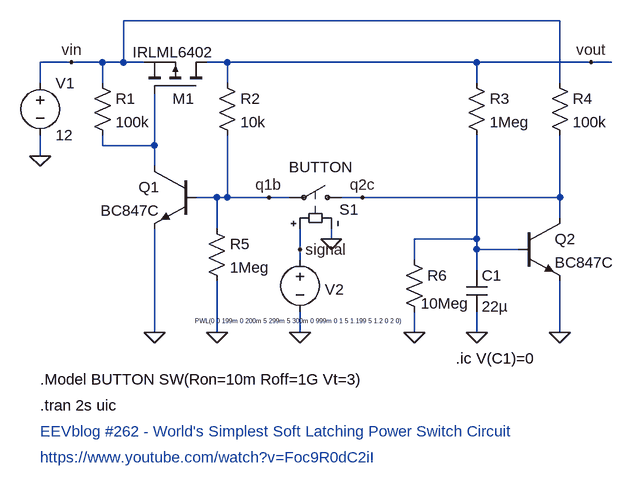
[diagram p0: schematic 02-soft_latch_power_switch.asc]
02-soft_latch_power_switch.asc, the LTspice schematic file:
Version 4
SHEET 1 1020 736
WIRE 752 0 80 0
WIRE 0 64 -48 64
WIRE 48 64 0 64
WIRE 80 64 80 0
WIRE 80 64 48 64
WIRE 112 64 80 64
WIRE 240 64 208 64
WIRE 624 64 240 64
WIRE 800 64 624 64
WIRE 832 64 800 64
WIRE -48 96 -48 64
WIRE 48 96 48 64
WIRE 240 96 240 64
WIRE 624 96 624 64
WIRE 752 96 752 0
WIRE 48 192 48 176
WIRE 128 192 128 112
WIRE 128 192 48 192
WIRE -48 208 -48 176
WIRE 128 224 128 192
WIRE 224 272 192 272
WIRE 240 272 240 176
WIRE 240 272 224 272
WIRE 304 272 240 272
WIRE 336 272 304 272
WIRE 448 272 416 272
WIRE 752 272 752 176
WIRE 752 272 448 272
WIRE 752 304 752 272
WIRE 224 320 224 272
WIRE 400 336 400 320
WIRE 624 336 624 176
WIRE 624 336 528 336
WIRE 352 352 352 320
WIRE 624 352 624 336
WIRE 688 352 624 352
WIRE 352 368 352 352
WIRE 528 368 528 336
WIRE 624 384 624 352
WIRE 128 480 128 320
WIRE 224 480 224 400
WIRE 352 480 352 448
WIRE 528 480 528 448
WIRE 624 480 624 448
WIRE 752 480 752 400
FLAG 752 480 0
FLAG 624 480 0
FLAG 400 336 0
FLAG 128 480 0
FLAG -48 208 0
FLAG 352 480 0
FLAG 0 64 vin
FLAG 800 64 vout
FLAG 304 272 q1b
FLAG 448 272 q2c
FLAG 352 352 signal
FLAG 224 480 0
FLAG 528 480 0
SYMBOL pmos 208 112 M270
WINDOW 0 -8 52 VLeft 2
WINDOW 3 64 114 VLeft 2
SYMATTR InstName M1
SYMATTR Value IRLML6402
SYMBOL res 32 80 R0
SYMATTR InstName R1
SYMATTR Value 100k
SYMBOL res 224 80 R0
SYMATTR InstName R2
SYMATTR Value 10k
SYMBOL npn 192 224 M0
SYMATTR InstName Q1
SYMATTR Value BC847C
SYMBOL res 608 80 R0
SYMATTR InstName R3
SYMATTR Value 1Meg
SYMBOL res 736 80 R0
SYMATTR InstName R4
SYMATTR Value 100k
SYMBOL npn 688 304 R0
SYMATTR InstName Q2
SYMATTR Value BC847C
SYMBOL cap 608 384 R0
SYMATTR InstName C1
SYMATTR Value 22µ
SYMBOL sw 432 272 M270
WINDOW 0 -19 19 VLeft 2
WINDOW 3 47 97 VLeft 2
SYMATTR InstName S1
SYMATTR Value BUTTON
SYMBOL voltage -48 80 R0
WINDOW 123 0 0 Left 0
WINDOW 39 0 0 Left 0
SYMATTR InstName V1
SYMATTR Value 12
SYMBOL voltage 352 352 R0
WINDOW 0 38 62 Left 2
WINDOW 3 -162 110 Left 0
WINDOW 123 0 0 Left 0
WINDOW 39 0 0 Left 0
SYMATTR InstName V2
SYMATTR Value PWL(0 0 199m 0 200m 5 299m 5 300m 0 999m 0 1 5 1.199 5 1.2 0 2 0)
SYMBOL res 208 304 R0
SYMATTR InstName R5
SYMATTR Value 1Meg
SYMBOL res 512 352 R0
WINDOW 3 26 83 Left 2
SYMATTR InstName R6
SYMATTR Value 10Meg
TEXT -48 552 Left 2 !.Model BUTTON SW(Ron=10m Roff=1G Vt=3)
TEXT -48 592 Left 2 !.tran 2s uic
TEXT 592 520 Left 2 !.ic V(C1)=0
TEXT -48 672 Left 2 ;https://www.youtube.com/watch?v=Foc9R0dC2iI
TEXT -48 632 Left 2 ;EEVblog #262 - World's Simplest Soft Latching Power Switch Circuit

The netlist it stands for:
* 02-soft_latch_power_switch.asc
M1 vout N001 vin vin IRLML6402
R1 vin N001 100k
R2 vout q1b 10k
Q1 N001 q1b 0 0 BC847C
R3 vout N002 1Meg
R4 vin q2c 100k
Q2 q2c N002 0 0 BC847C
C1 N002 0 22µ
S1 q2c q1b signal 0 BUTTON
V1 vin 0 12
V2 signal 0 PWL(0 0 199m 0 200m 5 299m 5 300m 0 999m 0 1 5 1.199 5 1.2 0 2 0)
R5 q1b 0 1Meg
R6 N002 0 10Meg
.model NPN NPN
.model PNP PNP
.lib standard.bjt
.model NMOS NMOS
.model PMOS PMOS
.lib standard.mos
.Model BUTTON SW(Ron=10m Roff=1G Vt=3)
.tran 2s uic
.ic V(C1)=0
* https://www.youtube.com/watch?v=Foc9R0dC2iI
* EEVblog #262 - World's Simplest Soft Latching Power Switch Circuit
.backanno
.end

* Results of the author's LTspice run, read from the files saved beside the schematic
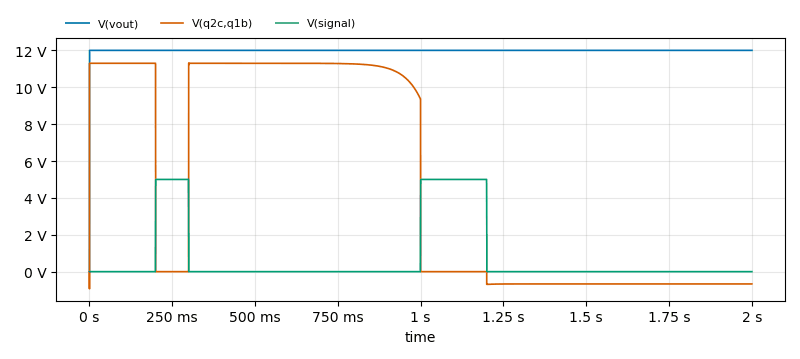
[diagram p1: Transient Analysis of 02-soft_latch_power_switch.asc, plotted from the saved traces]
* Transient Analysis, 1 run:
*   V(vout): min 0 V, max 12 V, average 12 V, rms 12 V, last 12 V
*   V(q2c,q1b): min -930.2 mV, max 11.3 V, average 4.767 V, rms 7.52 V, last -666.9 mV
*   V(signal): min 0 V, max 5 V, average 750 mV, rms 1.934 V, last 0 V